# Altium schematic sheet FMC_CONN_A1.SchDoc: FMC_CONN
size A3; DocumentNumber: 2; SheetNumber: 2; SheetTotal: 3
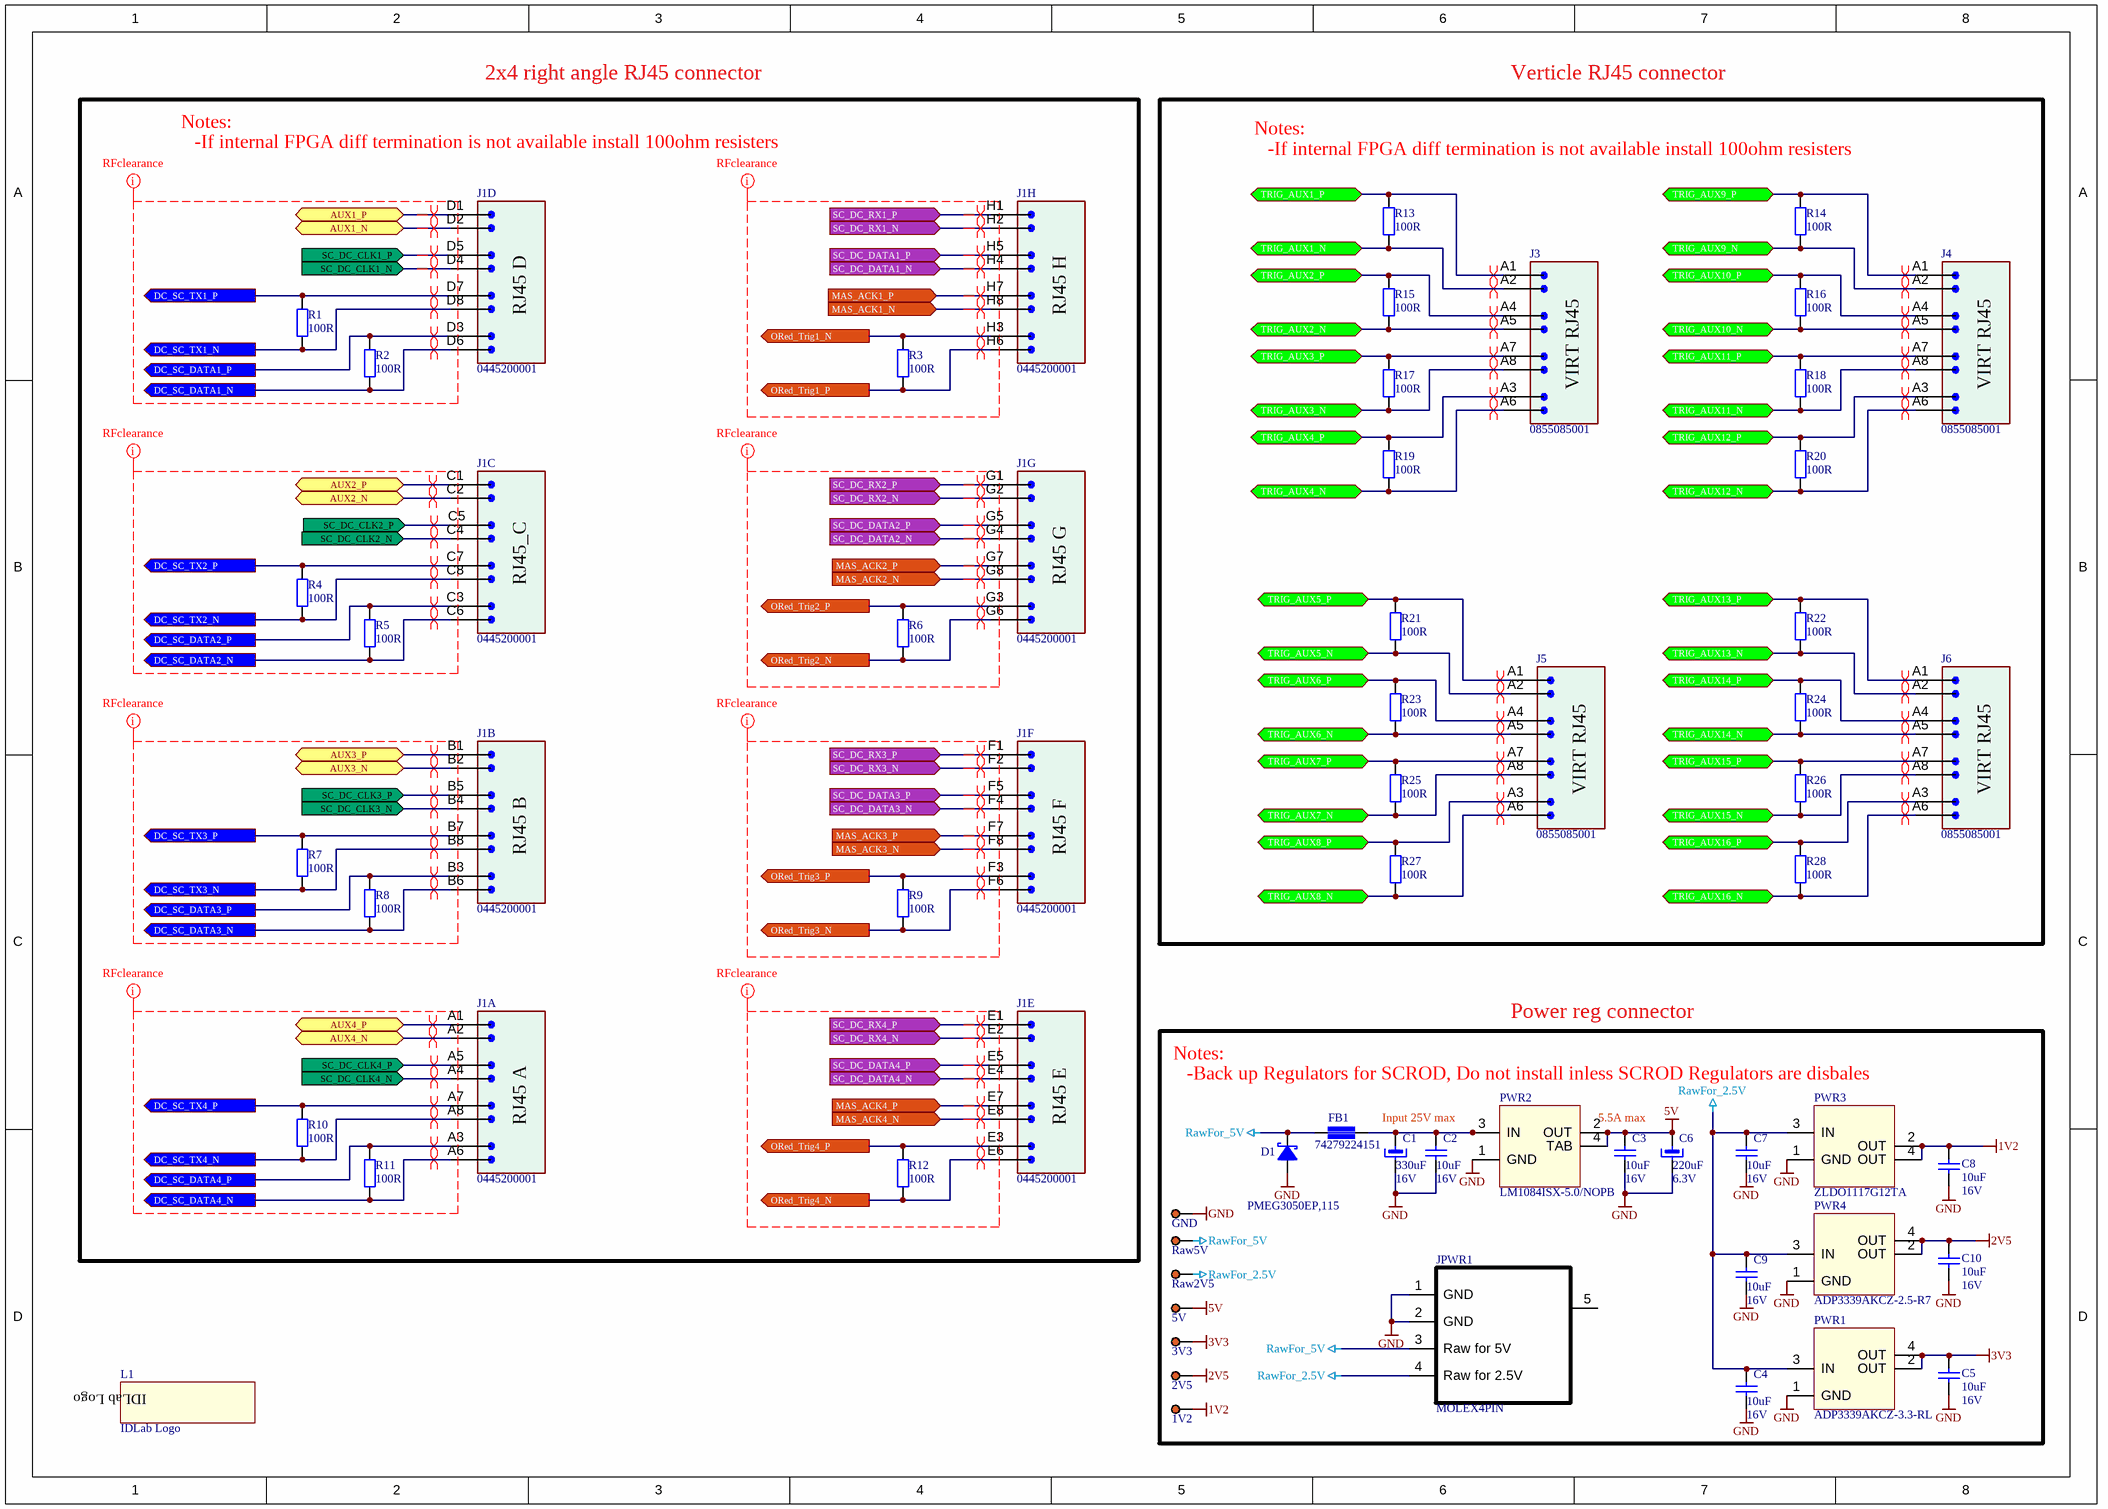
[diagram p0: FMC_CONN_A1.SchDoc]

## Parts
1V2  SP1.5S  [SP1.5SQ]  (value not drawn)  (no BOM)
2V5  SP1.5S  [SP1.5SQ]  (value not drawn)  (no BOM)
3V3  SP1.5S  [SP1.5SQ]  (value not drawn)  (no BOM)
5V  SP1.5S  [SP1.5SQ]  (value not drawn)  (no BOM)
C1  330uF  Voltage rating: 16V  [CTC-D7343-43]
C2  10uF  Voltage rating: 16V  [CC1206N1R]
C3  10uF  Voltage rating: 16V  [CC1206N1R]
C4  10uF  Voltage rating: 16V  [CC1206N1R]
C5  10uF  Voltage rating: 16V  [CC1206N1R]
C6  220uF  Voltage rating: 6.3V  [CTC-D7343-43]
C7  10uF  Voltage rating: 16V  [CC1206N1R]
C8  10uF  Voltage rating: 16V  [CC1206N1R]
C9  10uF  Voltage rating: 16V  [CC1206N1R]
C10  10uF  Voltage rating: 16V  [CC1206N1R]
D1  PMEG3050EP,115  [SOD128]
FB1  74279224151  [FB2220N1R]
GND  SP1.5S  [SP1.5SQ]  (value not drawn)  (no BOM)
J1  0445200001  [2X4 RJ45]  (parts A,B,C,D,E,F,G,H of 8)
J3  0855085001  [VIRT RJ45]
J4  0855085001  [VIRT RJ45]
J5  0855085001  [VIRT RJ45]
J6  0855085001  [VIRT RJ45]
JPWR1  MOLEX4PIN  [MOLEX_4PIN]
L1  IDLab Logo  [IDLab logo]
PWR1  ADP3339AKCZ-3.3-RL  [SOT223]
PWR2  LM1084ISX-5.0/NOPB  [TO-263-4 DDPAK]
PWR3  ZLDO1117G12TA  [SOT223]
PWR4  ADP3339AKCZ-2.5-R7  [SOT223]
R1  100R  [RC0402N1R]
R2  100R  [RC0402N1R]
R3  100R  [RC0402N1R]
R4  100R  [RC0402N1R]
R5  100R  [RC0402N1R]
R6  100R  [RC0402N1R]
R7  100R  [RC0402N1R]
R8  100R  [RC0402N1R]
R9  100R  [RC0402N1R]
R10  100R  [RC0402N1R]
R11  100R  [RC0402N1R]
R12  100R  [RC0402N1R]
R13  100R  [RC0402N1R]
R14  100R  [RC0402N1R]
R15  100R  [RC0402N1R]
R16  100R  [RC0402N1R]
R17  100R  [RC0402N1R]
R18  100R  [RC0402N1R]
R19  100R  [RC0402N1R]
R20  100R  [RC0402N1R]
R21  100R  [RC0402N1R]
R22  100R  [RC0402N1R]
R23  100R  [RC0402N1R]
R24  100R  [RC0402N1R]
R25  100R  [RC0402N1R]
R26  100R  [RC0402N1R]
R27  100R  [RC0402N1R]
R28  100R  [RC0402N1R]
Raw2V5  SP1.5S  [SP1.5SQ]  (value not drawn)  (no BOM)
Raw5V  SP1.5S  [SP1.5SQ]  (value not drawn)  (no BOM)

## Blocks framed on the sheet
2x4 right angle RJ45 connector: J1 R1-R12
Verticle RJ45 connector: J3-J6 R13-R28
Power reg connector: 1V2 2V5 3V3 5V C1-C10 D1 FB1 GND JPWR1 PWR1-PWR4 Raw2V5 Raw5V

## Ports
AUX1_N (bidir), AUX1_P (bidir), AUX2_N (bidir), AUX2_P (bidir), AUX3_N (bidir), AUX3_P (bidir), AUX4_N (bidir), AUX4_P (bidir), DC_SC_DATA1_N (out), DC_SC_DATA1_P (out), DC_SC_DATA2_N (out), DC_SC_DATA2_P (out), DC_SC_DATA3_N (out), DC_SC_DATA3_P (out), DC_SC_DATA4_N (out), DC_SC_DATA4_P (out), DC_SC_TX1_N (out), DC_SC_TX1_P (out), DC_SC_TX2_N (out), DC_SC_TX2_P (out), DC_SC_TX3_N (out), DC_SC_TX3_P (out), DC_SC_TX4_N (out), DC_SC_TX4_P (out), MAS_ACK1_N (in), MAS_ACK1_P (in), MAS_ACK2_N (in), MAS_ACK2_P (in), MAS_ACK3_N (in), MAS_ACK3_P (in), MAS_ACK4_N (in), MAS_ACK4_P (in), ORed_Trig1_N (out), ORed_Trig1_P (out), ORed_Trig2_N (out), ORed_Trig2_P (out), ORed_Trig3_N (out), ORed_Trig3_P (out), ORed_Trig4_N (out), ORed_Trig4_P (out), SC_DC_CLK1_N (in), SC_DC_CLK1_P (in), SC_DC_CLK2_N (in), SC_DC_CLK2_P (in), SC_DC_CLK3_N (in), SC_DC_CLK3_P (in), SC_DC_CLK4_N (in), SC_DC_CLK4_P (in), SC_DC_DATA1_N (in), SC_DC_DATA1_P (in), SC_DC_DATA2_N (in), SC_DC_DATA2_P (in), SC_DC_DATA3_N (in), SC_DC_DATA3_P (in), SC_DC_DATA4_N (in), SC_DC_DATA4_P (in), SC_DC_RX1_N (in), SC_DC_RX1_P (in), SC_DC_RX2_N (in), SC_DC_RX2_P (in), SC_DC_RX3_N (in), SC_DC_RX3_P (in), SC_DC_RX4_N (in), SC_DC_RX4_P (in), TRIG_AUX1_N (bidir), TRIG_AUX1_P (bidir), TRIG_AUX2_N (bidir), TRIG_AUX2_P (bidir), TRIG_AUX3_N (bidir), TRIG_AUX3_P (bidir), TRIG_AUX4_N (bidir), TRIG_AUX4_P (bidir), TRIG_AUX5_N (bidir), TRIG_AUX5_P (bidir), TRIG_AUX6_N (bidir), TRIG_AUX6_P (bidir), TRIG_AUX7_N (bidir), TRIG_AUX7_P (bidir), TRIG_AUX8_N (bidir), TRIG_AUX8_P (bidir), TRIG_AUX9_N (bidir), TRIG_AUX9_P (bidir), TRIG_AUX10_N (bidir), TRIG_AUX10_P (bidir), TRIG_AUX11_N (bidir), TRIG_AUX11_P (bidir), TRIG_AUX12_N (bidir), TRIG_AUX12_P (bidir), TRIG_AUX13_N (bidir), TRIG_AUX13_P (bidir), TRIG_AUX14_N (bidir), TRIG_AUX14_P (bidir), TRIG_AUX15_N (bidir), TRIG_AUX15_P (bidir), TRIG_AUX16_N (bidir), TRIG_AUX16_P (bidir)

## Nets
1V2: 1V2.1 C8.2 PWR3.2(OUT) PWR3.4(OUT)
2V5: 2V5.1 C10.2 PWR4.2(OUT) PWR4.4(OUT)
3V3: 3V3.1 C5.2 PWR1.2(OUT) PWR1.4(OUT)
5V: 5V.1 C3.2 C6.1 PWR2.2(OUT) PWR2.4(TAB)
GND: C1.2 C2.1 C3.1 C4.1 C5.1 C6.2 C7.1 C8.1 C9.1 C10.1 D1.2(A) GND.1 JPWR1.1(GND) JPWR1.2(GND) PWR1.1(GND) PWR2.1(GND) PWR3.1(GND) PWR4.1(GND)
RawFor_2.5V: C4.2 C7.2 C9.2 JPWR1.4(Raw_for_2.5V) PWR1.3(IN) PWR3.3(IN) PWR4.3(IN) Raw2V5.1
RawFor_5V: D1.1(C) FB1.1 JPWR1.3(Raw_for_5V) Raw5V.1
AUX1_N: J1.D2 ; port AUX1_N
AUX1_P: J1.D1 ; port AUX1_P
AUX2_N: J1.C2 ; port AUX2_N
AUX2_P: J1.C1 ; port AUX2_P
AUX3_N: J1.B2 ; port AUX3_N
AUX3_P: J1.B1 ; port AUX3_P
AUX4_N: J1.A2 ; port AUX4_N
AUX4_P: J1.A1 ; port AUX4_P
DC_SC_DATA1_N: J1.D6 R2.1 ; port DC_SC_DATA1_N
DC_SC_DATA1_P: J1.D3 R2.2 ; port DC_SC_DATA1_P
DC_SC_DATA2_N: J1.C6 R5.1 ; port DC_SC_DATA2_N
DC_SC_DATA2_P: J1.C3 R5.2 ; port DC_SC_DATA2_P
DC_SC_DATA3_N: J1.B6 R8.1 ; port DC_SC_DATA3_N
DC_SC_DATA3_P: J1.B3 R8.2 ; port DC_SC_DATA3_P
DC_SC_DATA4_N: J1.A6 R11.1 ; port DC_SC_DATA4_N
DC_SC_DATA4_P: J1.A3 R11.2 ; port DC_SC_DATA4_P
DC_SC_TX1_N: J1.D8 R1.1 ; port DC_SC_TX1_N
DC_SC_TX1_P: J1.D7 R1.2 ; port DC_SC_TX1_P
DC_SC_TX2_N: J1.C8 R4.1 ; port DC_SC_TX2_N
DC_SC_TX2_P: J1.C7 R4.2 ; port DC_SC_TX2_P
DC_SC_TX3_N: J1.B8 R7.1 ; port DC_SC_TX3_N
DC_SC_TX3_P: J1.B7 R7.2 ; port DC_SC_TX3_P
DC_SC_TX4_N: J1.A8 R10.1 ; port DC_SC_TX4_N
DC_SC_TX4_P: J1.A7 R10.2 ; port DC_SC_TX4_P
MAS_ACK1_N: J1.H8 ; port MAS_ACK1_N
MAS_ACK1_P: J1.H7 ; port MAS_ACK1_P
MAS_ACK2_N: J1.G8 ; port MAS_ACK2_N
MAS_ACK2_P: J1.G7 ; port MAS_ACK2_P
MAS_ACK3_N: J1.F8 ; port MAS_ACK3_N
MAS_ACK3_P: J1.F7 ; port MAS_ACK3_P
MAS_ACK4_N: J1.E8 ; port MAS_ACK4_N
MAS_ACK4_P: J1.E7 ; port MAS_ACK4_P
ORed_Trig1_N: J1.H3 R3.2 ; port ORed_Trig1_N
ORed_Trig1_P: J1.H6 R3.1 ; port ORed_Trig1_P
ORed_Trig2_N: J1.G6 R6.1 ; port ORed_Trig2_N
ORed_Trig2_P: J1.G3 R6.2 ; port ORed_Trig2_P
ORed_Trig3_N: J1.F6 R9.1 ; port ORed_Trig3_N
ORed_Trig3_P: J1.F3 R9.2 ; port ORed_Trig3_P
ORed_Trig4_N: J1.E6 R12.1 ; port ORed_Trig4_N
ORed_Trig4_P: J1.E3 R12.2 ; port ORed_Trig4_P
SC_DC_CLK1_N: J1.D4 ; port SC_DC_CLK1_N
SC_DC_CLK1_P: J1.D5 ; port SC_DC_CLK1_P
SC_DC_CLK2_N: J1.C4 ; port SC_DC_CLK2_N
SC_DC_CLK2_P: J1.C5 ; port SC_DC_CLK2_P
SC_DC_CLK3_N: J1.B4(B5) ; port SC_DC_CLK3_N
SC_DC_CLK3_P: J1.B5 ; port SC_DC_CLK3_P
SC_DC_CLK4_N: J1.A4 ; port SC_DC_CLK4_N
SC_DC_CLK4_P: J1.A5 ; port SC_DC_CLK4_P
SC_DC_DATA1_N: J1.H4 ; port SC_DC_DATA1_N
SC_DC_DATA1_P: J1.H5 ; port SC_DC_DATA1_P
SC_DC_DATA2_N: J1.G4 ; port SC_DC_DATA2_N
SC_DC_DATA2_P: J1.G5 ; port SC_DC_DATA2_P
SC_DC_DATA3_N: J1.F4 ; port SC_DC_DATA3_N
SC_DC_DATA3_P: J1.F5 ; port SC_DC_DATA3_P
SC_DC_DATA4_N: J1.E4 ; port SC_DC_DATA4_N
SC_DC_DATA4_P: J1.E5 ; port SC_DC_DATA4_P
SC_DC_RX1_N: J1.H2 ; port SC_DC_RX1_N
SC_DC_RX1_P: J1.H1 ; port SC_DC_RX1_P
SC_DC_RX2_N: J1.G2 ; port SC_DC_RX2_N
SC_DC_RX2_P: J1.G1 ; port SC_DC_RX2_P
SC_DC_RX3_N: J1.F2 ; port SC_DC_RX3_N
SC_DC_RX3_P: J1.F1 ; port SC_DC_RX3_P
SC_DC_RX4_N: J1.E2 ; port SC_DC_RX4_N
SC_DC_RX4_P: J1.E1 ; port SC_DC_RX4_P
TRIG_AUX1_N: J3.A2 R13.1 ; port TRIG_AUX1_N
TRIG_AUX1_P: J3.A1 R13.2 ; port TRIG_AUX1_P
TRIG_AUX2_N: J3.A5 R15.1 ; port TRIG_AUX2_N
TRIG_AUX2_P: J3.A4 R15.2 ; port TRIG_AUX2_P
TRIG_AUX3_N: J3.A8 R17.1 ; port TRIG_AUX3_N
TRIG_AUX3_P: J3.A7 R17.2 ; port TRIG_AUX3_P
TRIG_AUX4_N: J3.A6 R19.1 ; port TRIG_AUX4_N
TRIG_AUX4_P: J3.A3 R19.2 ; port TRIG_AUX4_P
TRIG_AUX5_N: J5.A2 R21.1 ; port TRIG_AUX5_N
TRIG_AUX5_P: J5.A1 R21.2 ; port TRIG_AUX5_P
TRIG_AUX6_N: J5.A5 R23.1 ; port TRIG_AUX6_N
TRIG_AUX6_P: J5.A4 R23.2 ; port TRIG_AUX6_P
TRIG_AUX7_N: J5.A8 R25.1 ; port TRIG_AUX7_N
TRIG_AUX7_P: J5.A7 R25.2 ; port TRIG_AUX7_P
TRIG_AUX8_N: J5.A6 R27.1 ; port TRIG_AUX8_N
TRIG_AUX8_P: J5.A3 R27.2 ; port TRIG_AUX8_P
TRIG_AUX9_N: J4.A2 R14.1 ; port TRIG_AUX9_N
TRIG_AUX9_P: J4.A1 R14.2 ; port TRIG_AUX9_P
TRIG_AUX10_N: J4.A5 R16.1 ; port TRIG_AUX10_N
TRIG_AUX10_P: J4.A4 R16.2 ; port TRIG_AUX10_P
TRIG_AUX11_N: J4.A8 R18.1 ; port TRIG_AUX11_N
TRIG_AUX11_P: J4.A7 R18.2 ; port TRIG_AUX11_P
TRIG_AUX12_N: J4.A6 R20.1 ; port TRIG_AUX12_N
TRIG_AUX12_P: J4.A3 R20.2 ; port TRIG_AUX12_P
TRIG_AUX13_N: J6.A2 R22.1 ; port TRIG_AUX13_N
TRIG_AUX13_P: J6.A1 R22.2 ; port TRIG_AUX13_P
TRIG_AUX14_N: J6.A5 R24.1 ; port TRIG_AUX14_N
TRIG_AUX14_P: J6.A4 R24.2 ; port TRIG_AUX14_P
TRIG_AUX15_N: J6.A8 R26.1 ; port TRIG_AUX15_N
TRIG_AUX15_P: J6.A7 R26.2 ; port TRIG_AUX15_P
TRIG_AUX16_N: J6.A6 R28.1 ; port TRIG_AUX16_N
TRIG_AUX16_P: J6.A3 R28.2 ; port TRIG_AUX16_P
NetC1_1: C1.1 C2.2 FB1.2 PWR2.3(IN)

Not connected (* = marked no-connect by the designer): JPWR1 5

## Layout directives
net class RF: (no net found under the mark)
differential pair: AUX1_N, AUX1_P, AUX2_N, AUX2_P, AUX3_N, AUX3_P, AUX4_N, AUX4_P, DC_SC_DATA1_N, DC_SC_DATA1_P, DC_SC_DATA2_N, DC_SC_DATA2_P, DC_SC_DATA3_N, DC_SC_DATA3_P, DC_SC_DATA4_N, DC_SC_DATA4_P, DC_SC_TX1_N, DC_SC_TX1_P, DC_SC_TX2_N, DC_SC_TX2_P, DC_SC_TX3_N, DC_SC_TX3_P, DC_SC_TX4_N, DC_SC_TX4_P, MAS_ACK1_N, MAS_ACK1_P, MAS_ACK2_N, MAS_ACK2_P, MAS_ACK3_N, MAS_ACK3_P, MAS_ACK4_N, MAS_ACK4_P, ORed_Trig1_N, ORed_Trig1_P, ORed_Trig2_N, ORed_Trig2_P, ORed_Trig3_N, ORed_Trig3_P, ORed_Trig4_N, ORed_Trig4_P, SC_DC_CLK1_N, SC_DC_CLK1_P, SC_DC_CLK2_N, SC_DC_CLK2_P, SC_DC_CLK3_N, SC_DC_CLK3_P, SC_DC_CLK4_N, SC_DC_CLK4_P, SC_DC_DATA1_N, SC_DC_DATA1_P, SC_DC_DATA2_N, SC_DC_DATA2_P, SC_DC_DATA3_N, SC_DC_DATA3_P, SC_DC_DATA4_N, SC_DC_DATA4_P, SC_DC_RX1_N, SC_DC_RX1_P, SC_DC_RX2_N, SC_DC_RX2_P, SC_DC_RX3_N, SC_DC_RX3_P, SC_DC_RX4_N, SC_DC_RX4_P, TRIG_AUX1_N, TRIG_AUX1_P, TRIG_AUX2_N, TRIG_AUX2_P, TRIG_AUX3_N, TRIG_AUX3_P, TRIG_AUX4_N, TRIG_AUX4_P, TRIG_AUX5_N, TRIG_AUX5_P, TRIG_AUX6_N, TRIG_AUX6_P, TRIG_AUX7_N, TRIG_AUX7_P, TRIG_AUX8_N, TRIG_AUX8_P, TRIG_AUX9_N, TRIG_AUX9_P, TRIG_AUX10_N, TRIG_AUX10_P, TRIG_AUX11_N, TRIG_AUX11_P, TRIG_AUX12_N, TRIG_AUX12_P, TRIG_AUX13_N, TRIG_AUX13_P, TRIG_AUX14_N, TRIG_AUX14_P, TRIG_AUX15_N, TRIG_AUX15_P, TRIG_AUX16_N, TRIG_AUX16_P

## Notes on the sheet
- Notes:
- -If internal FPGA diff termination is not available install 100ohm resisters
- -Back up Regulators for SCROD, Do not install inless SCROD Regulators are disbales
- Input 25V max
- 5.5A max
- Board:
- High Energy Physics Group, Instrumentation Development Lab
- Drawn By:
- Designer:
- Approved By:
- Revision:
- IDLAB design #:
- Variant:
- Sheet Title:
- Modif. Date:
- Sheet       of
- (in symbol 2x4 RJ45 CONN, part A) RJ45 A
- (in symbol 2x4 RJ45 CONN, part B) RJ45 B
- (in symbol 2x4 RJ45 CONN, part C) RJ45_C
- (in symbol 2x4 RJ45 CONN, part D) RJ45 D
- (in symbol 2x4 RJ45 CONN, part E) RJ45 E
- (in symbol 2x4 RJ45 CONN, part F) RJ45 F
- (in symbol 2x4 RJ45 CONN, part G) RJ45 G
- (in symbol 2x4 RJ45 CONN, part H) RJ45 H
- (in symbol VIRT RJ45 CONN) VIRT RJ45

## Library data of the parts
1V2 2V5 3V3 5V GND Raw2V5 Raw5V = SP1.5S: Wire solder pin 1.5mm; Sort: 610; Tech: THDW; Price: 0
C1 = CAPT7343_330U_16V: 330µF Molded Tantalum - Polymer Capacitors 16V; Manufacturer: Kemet; Manufacturer No: T521X337M016ATE050; Tech: SMDR; Package: Tant SMD D 7343-43; Supplier 1: Digi-Key; Supplier Part Number 1: 399-10365-6-ND
C2-C5 C7-C10 = CAPCC1206_10U_16VX7R: 10µF 16V Ceramic Capacitor X7R 1206; Manufacturer: TDK; Manufacturer No: C3216X7R1C106M160AC; Tech: SMDR; Package: Cap Chip 1206; Supplier 1: Digi-Key; Supplier Part Number 1: 445-1601-1-ND
C6 = CAPT7343_220U_6.3V: 220µF 6.3V Aluminum - Polymer Capacitors; Manufacturer: Panasonic; Manufacturer No: EEF-UE0J221LR; Tech: SMDR; Package: Tant SMD D 7343-43; Supplier 1: Digi-Key; Supplier Part Number 1: PCE4263CT-ND
D1 = Schottky_Diodes_5A_30V: DIODE SCHOTTKY 30V 5A SOD128  500ns 0.36Vf; Manufacturer: NXP; Tech: SMDR; Package: SMB; Manufacturer No: PMEG3050EP,115; Supplier 1: Digi-Key; Supplier Part Number 1: 568-6753-6-ND
FB1 = FB2220-74279224151: Feritte filter smd 2220 5A 10mRdc 150Rac; Manufacturer: Wurth; Tech: SMDR; Manufacturer No: 74279224151; Package: Filter Chip 2220; Supplier 1: Digi-Key; Supplier Part Number 1: 732-3423-1-ND; Supplier 2: Mouser; Supplier Part Number 2: 710-74279224151
J1 = 2x4 RJ45 CONN: CONN MOD JACK 8P8C R/A SHIELDED; Manufacturer: Molex, LLC; Tech: Through Hole, Right Angle; Manufacturer No: 0445200001; Package: RJ45, Ethernet; Supplier 1: Digi-Key; Supplier Part Number 1: WM14601-ND
J3-J6 = VIRT RJ45 CONN: CONN MOD JACK 8P8C R/A SHIELDED; Manufacturer: Molex, LLC; Tech: Through Hole, virtcal; Manufacturer No: 0855085001; Package: 8p8c virt; Supplier 1: Digi-Key; Supplier Part Number 1: WM4590-ND
PWR1 = 3V3 REG LDO: IC REG LDO 3.3V 1.5A SOT223-3; Manufacturer: Analog Devices Inc.; Tech: Surface Mount; Manufacturer No: ADP3339AKCZ-3.3-RL; Supplier 1: Digi-Key; Supplier Part Number 1: ADP3339AKCZ-3.3-RLCT-ND
PWR2 = 5V 5.5A REG LDO: IC REG LDO 5V 5A DDPAK/TO-263-3; Manufacturer: Texas Instruments; Tech: Surface Mount; Manufacturer No: LM1084ISX-5.0/NOPB; Supplier 1: Digi-Key; Supplier Part Number 1: LM1084ISX-5.0/NOPBCT-ND
PWR3 = 1V2 REG LDO: IC REG LDO 1.2V 1A SOT223-3; Manufacturer: Diodes Incorporated; Tech: Surface Mount; Manufacturer No: ZLDO1117G12TA; Supplier 1: Digi-Key; Supplier Part Number 1: ZLDO1117G12DICT-ND
PWR4 = 2V5 REG LDO: IC REG LDO 2.5V 1.5A SOT223-3; Manufacturer: Analog Devices Inc.; Tech: Surface Mount; Manufacturer No: ADP3339AKCZ-2.5-R7; Supplier 1: Digi-Key; Supplier Part Number 1: ADP3339AKCZ-2.5-R7CT-ND
R1-R28 = RES0402-100R-1%100PPM: RES SMD 100 OHM 1% 1/10W 0402; Manufacturer: Panasonic; Manufacturer No: ERJ-2RKF1000X; Tech: SMDR; Package: Res Chip 0402; Supplier 1: Digi-Key; Supplier Part Number 1: P100LCT-ND